# EAGLE design th-566-vco-io (EAGLE 9.6.2)
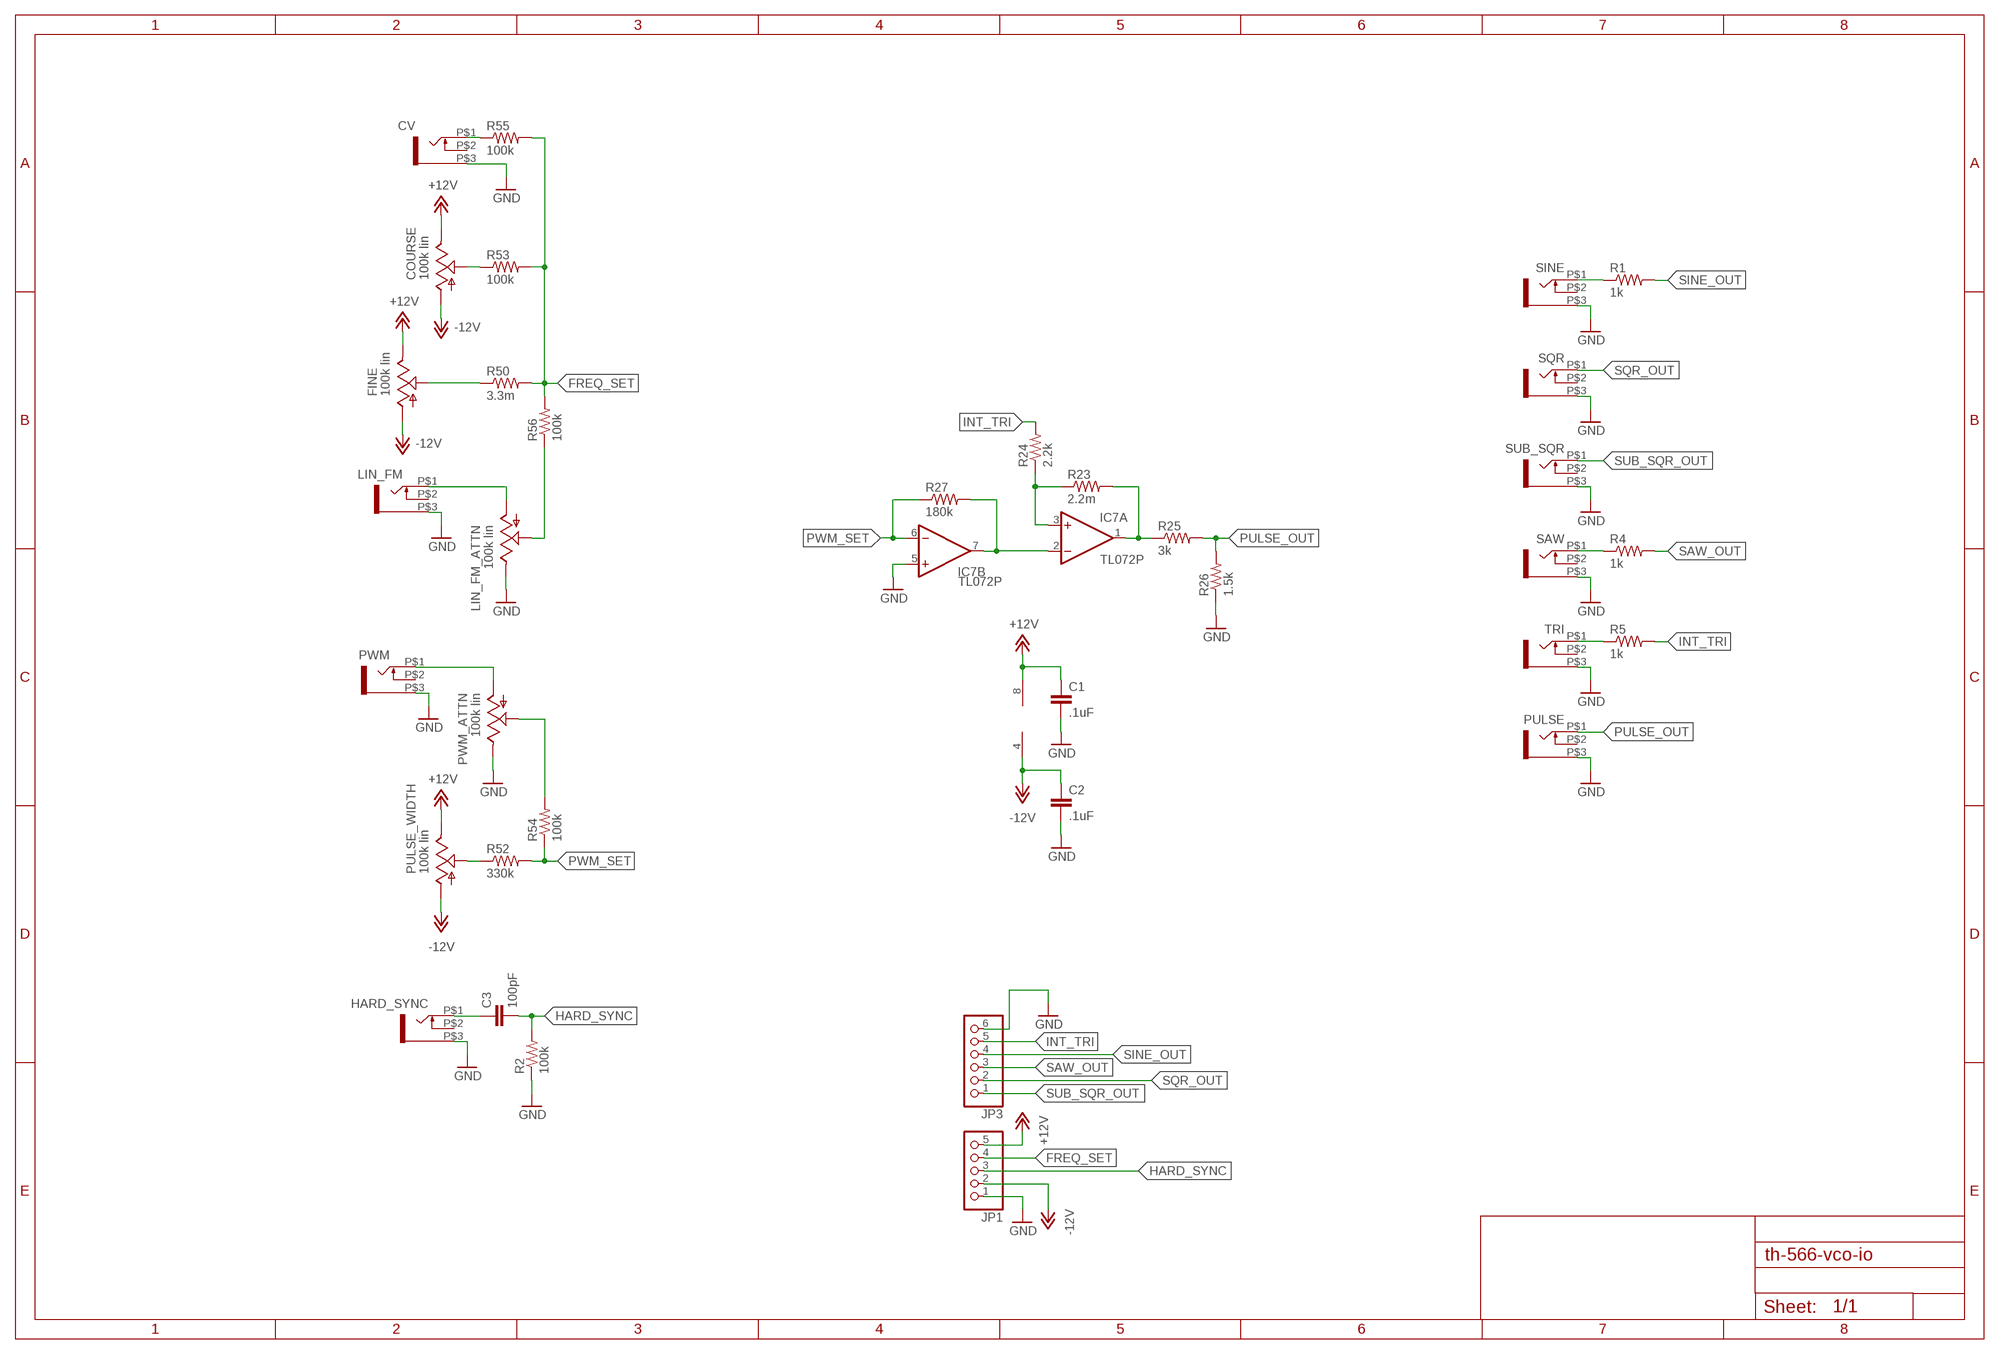
[diagram p0: schematic, sheet 1]

## Parts
C1  .1uF  C-EU050-024X044  [C050-024X044]
C2  .1uF  C-EU050-024X044  [C050-024X044]
C3  100pF  C-EU050-024X044  [C050-024X044]
COURSE  100k lin  ALPHA-9MMA  [EVUF]
CV  WQP-PJ301M-12_JACK  [WQP-PJ301M-12_JACK]
FINE  100k lin  ALPHA-9MMA  [EVUF]
HARD_SYNC  WQP-PJ301M-12_JACK  [WQP-PJ301M-12_JACK]
IC7  TL072P  [DIL08]
JP1  PINHD-1X5  [1X05]
JP3  PINHD-1X6  [1X06]
LIN_FM  WQP-PJ301M-12_JACK  [WQP-PJ301M-12_JACK]
LIN_FM_ATTN  100k lin  ALPHA-9MMA  [EVUF]
PULSE  WQP-PJ301M-12_JACK  [WQP-PJ301M-12_JACK]
PULSE_WIDTH  100k lin  ALPHA-9MMA  [EVUF]
PWM  WQP-PJ301M-12_JACK  [WQP-PJ301M-12_JACK]
PWM_ATTN  100k lin  ALPHA-9MMA  [EVUF]
R1  1k  R-US_0204/7  [0204/7]
R2  100k  R-US_0204/7  [0204/7]
R4  1k  R-US_0204/7  [0204/7]
R5  1k  R-US_0204/7  [0204/7]
R23  2.2m  R-US_0204/7  [0204/7]
R24  2.2k  R-US_0204/7  [0204/7]
R25  3k  R-US_0204/7  [0204/7]
R26  1.5k  R-US_0204/7  [0204/7]
R27  180k  R-US_0204/7  [0204/7]
R50  3.3m  R-US_0204/7  [0204/7]
R52  330k  R-US_0204/7  [0204/7]
R53  100k  R-US_0204/7  [0204/7]
R54  100k  R-US_0204/7  [0204/7]
R55  100k  R-US_0204/7  [0204/7]
R56  100k  R-US_0204/7  [0204/7]
SAW  WQP-PJ301M-12_JACK  [WQP-PJ301M-12_JACK]
SINE  WQP-PJ301M-12_JACK  [WQP-PJ301M-12_JACK]
SQR  WQP-PJ301M-12_JACK  [WQP-PJ301M-12_JACK]
SUB_SQR  WQP-PJ301M-12_JACK  [WQP-PJ301M-12_JACK]
TRI  WQP-PJ301M-12_JACK  [WQP-PJ301M-12_JACK]

## Nets
+12V: C1.1 COURSE.3(E) FINE.3(E) IC7.8(P:V+) JP1.5 PULSE_WIDTH.3(E)
-12V: C2.1 COURSE.1(A) FINE.1(A) IC7.4(P:V-) JP1.2 PULSE_WIDTH.1(A)
FREQ_SET: JP1.4 R50.2 R53.2 R55.2 R56.2
GND: C1.2 C2.2 CV.P$3 HARD_SYNC.P$3 IC7.5(B:+IN) JP1.1 JP3.6 LIN_FM.P$3 LIN_FM_ATTN.3(E) PULSE.P$3 PWM.P$3 PWM_ATTN.3(E) R2.1 R26.1 SAW.P$3 SINE.P$3 SQR.P$3 SUB_SQR.P$3 TRI.P$3
HARD_SYNC: C3.2 JP1.3 R2.2
INT_TRI: JP3.5 R5.2 R24.2
IO_PWM_IN: PWM_ATTN.2(S) R54.2
N$1: R1.1 SINE.P$1
N$2: R5.1 TRI.P$1
N$3: R4.1 SAW.P$1
N$5: C3.1 HARD_SYNC.P$1
N$10: IC7.1(A:OUT) R23.2 R25.1
N$11: IC7.2(A:-IN) IC7.7(B:OUT) R27.2
N$20: IC7.3(A:+IN) R23.1 R24.1
N$37: PWM.P$1 PWM_ATTN.1(A)
N$38: PULSE_WIDTH.2(S) R52.1
N$40: FINE.2(S) R50.1
N$41: COURSE.2(S) R53.1
N$42: CV.P$1 R55.1
N$43: LIN_FM.P$1 LIN_FM_ATTN.1(A)
N$44: LIN_FM_ATTN.2(S) R56.1
PULSE_OUT: PULSE.P$1 R25.2 R26.2
PWM_SET: IC7.6(B:-IN) R27.1 R52.2 R54.1
SAW_OUT: JP3.3 R4.2
SINE_OUT: JP3.4 R1.2
SQR_OUT: JP3.2 SQR.P$1
SUB_SQR_OUT: JP3.1 SUB_SQR.P$1
Unconnected: CV.P$2 HARD_SYNC.P$2 LIN_FM.P$2 PULSE.P$2 PWM.P$2 SAW.P$2 SINE.P$2 SQR.P$2 SUB_SQR.P$2 TRI.P$2

## Library data of the parts
C1-C3 = rcl:C-EU: CAPACITOR, European symbol; SPICEPREFIX: C
COURSE FINE LIN_FM_ATTN PULSE_WIDTH PWM_ATTN = TomW:ALPHA-9MM: 9 mm Square Rotary Potentiometers Source: Panasonic
CV HARD_SYNC LIN_FM PULSE PWM SAW SINE SQR SUB_SQR TRI = thonkiconn:WQP-PJ301M-12_JACK
IC7 = TomW:TL072: OP AMP
JP1 = pinhead:PINHD-1X5: PIN HEADER
JP3 = pinhead:PINHD-1X6: PIN HEADER
R1 R2 R4 R5 R23-R27 R50 R52-R56 = resistor:R-US_: RESISTOR, American symbol

## Board
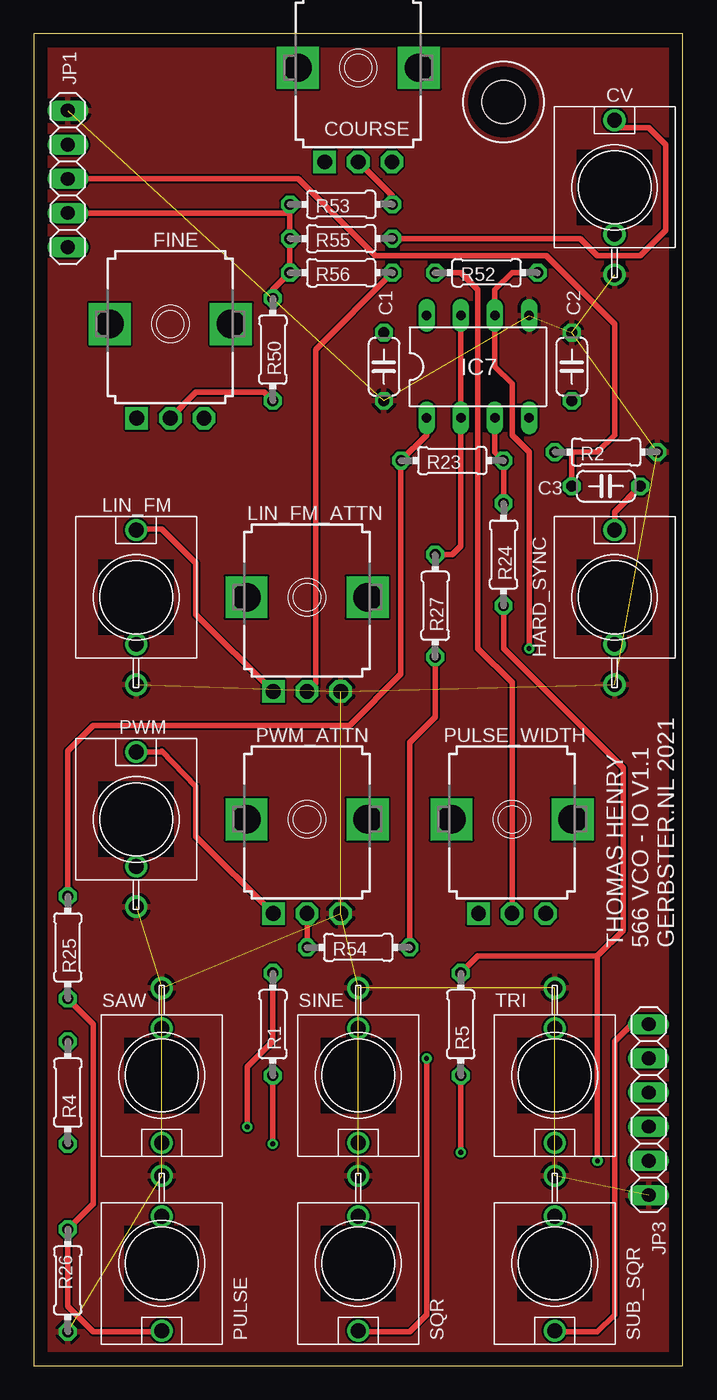
[diagram p1: board, top side]
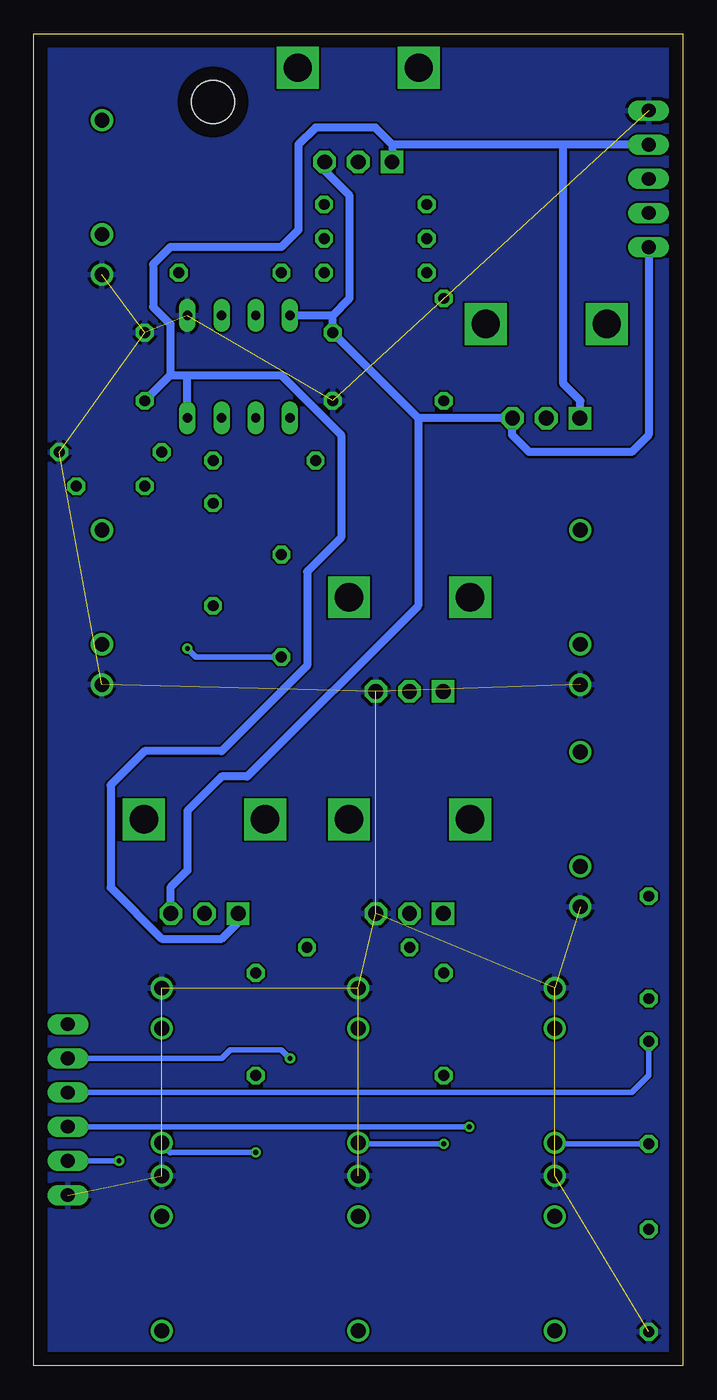
[diagram p2: board, bottom side, seen from below]

Size 48.26 x 99.06 mm. Coordinates in mm from the lower left corner, seen from the top.
Outline: 0,0 48.26,0 48.26,99.06 0,99.05 0,0
Copper layers (1*16): Top 0.035mm / dielectric 1.5mm / Bottom 0.035mm
Design rules "default": minimum track width 6mil, minimum drill 0.35mm, track to track 6mil, track to pad 6mil, pad to pad 6mil, via to via 6mil, smd to smd 6mil, copper to edge 40mil, drill to drill 6mil, minimum pad ring 10mil, minimum via ring 8mil, stop-mask expansion 4mil, vias tented up to drill 0mil, thermal gap 10mil
Holes 3.2 mm at 34.92,93.98

### Footprints (pad centres in the part's own frame; a part is rotated, then mirrored left to right if it is on the bottom)
C050-024X044 = drill 0.813 octagon: 1 -2.54,0; 2 2.54,0
EVUF = drill 1.1 pad 1.676 square: 1 -2.5,-7 | drill 1.1 pad 1.676 octagon: 2 0,-7; 3 2.5,-7 | drill 2.1 pad 2.8 square: M1 4.5,0; M2 -4.5,0
WQP-PJ301M-12_JACK = drill 1.1: P$1 0,5; P$2 0,-3.5; P$3 0,-6.5
DIL08 = drill 0.7 long: 1 -3.81,-3.81; 2 -1.27,-3.81; 3 1.27,-3.81; 4 3.81,-3.81; 5 3.81,3.81; 6 1.27,3.81; 7 -1.27,3.81; 8 -3.81,3.81
1X05 = drill 1.016 long: 1 -5.08,0; 2 -2.54,0; 3 0,0; 4 2.54,0; 5 5.08,0
1X06 = drill 1.016 long: 1 -6.35,0; 2 -3.81,0; 3 -1.27,0; 4 1.27,0; 5 3.81,0; 6 6.35,0
0204/7 = drill 0.813 octagon: 1 -3.81,0; 2 3.81,0

### Placement (x,y rotation side)
C1  26.04,74.3 270 top
C2  40.01,74.3 90 top
C3  42.55,65.41 180 top
COURSE  24.13,96.52 0 top
CV  43.18,87.63 0 top
FINE  10.16,77.47 0 top
HARD_SYNC  43.18,57.15 0 top
IC7  33.02,74.3 0 top
JP1  2.54,88.27 270 top
JP3  45.72,19.05 270 top
LIN_FM  7.62,57.15 0 top
LIN_FM_ATTN  20.32,57.15 0 top
PULSE  9.53,7.62 180 top
PULSE_WIDTH  35.56,40.64 0 top
PWM  7.62,40.64 0 top
PWM_ATTN  20.32,40.64 0 top
R1  17.78,25.4 90 top
R2  42.55,67.94 180 top
R4  2.54,20.32 90 top
R5  31.75,25.4 90 top
R23  31.11,67.31 180 top
R24  34.92,60.33 270 top
R25  2.54,31.11 270 top
R26  2.54,6.35 90 top
R27  29.84,56.52 90 top
R50  17.78,75.56 90 top
R52  33.66,81.28 0 top
R53  22.86,86.36 180 top
R54  24.13,31.11 180 top
R55  22.86,83.82 180 top
R56  22.86,81.28 180 top
SAW  9.53,21.59 180 top
SINE  24.13,21.59 180 top
SQR  24.13,7.62 180 top
SUB_SQR  38.73,7.62 180 top
TRI  38.73,21.59 180 top

### Tracks (layer width: path | path; a pad name or v marks a point on that pad's centre or on a via)
+12V
  Bottom 0.61: JP1.5 2.54,69.22 3.81,67.94 11.43,67.94 12.7,69.22 12.7,70.47 | 12.7,70.48 12.66,70.48 FINE.3 12.7,70.47 | 19.68,70.48 C1.1 26.04,78.11 | 26.04,78.11 IC7.8 | 26.04,78.11 24.77,79.38 24.77,87 26.67,88.9 26.67,89.52 COURSE.3 | 12.7,70.48 19.68,70.48 | PULSE_WIDTH.3 38.1,33.64 38.1,35.56 36.83,36.83 36.83,41.27 34.29,43.81 32.38,43.81 19.68,56.52 19.68,70.48 | 12.7,70.47 12.7,70.48
-12V
  Bottom 0.61: JP1.2 8.89,90.81 | 8.89,90.81 21.59,90.81 | 21.59,90.81 21.59,89.52 COURSE.1 | 21.59,90.81 22.86,92.08 27.3,92.08 28.57,90.81 28.57,84.45 29.84,83.19 38.1,83.19 39.37,81.92 39.37,78.74 38.1,77.47 38.1,73.66 | C2.1 38.1,73.66 | 38.1,73.66 36.83,73.66 | IC7.4 36.83,73.66 | 36.83,73.66 29.84,73.66 25.4,69.22 25.4,61.59 27.94,59.05 27.94,52.07 34.29,45.72 40.01,45.72 42.55,43.18 42.55,35.56 38.73,31.75 34.29,31.75 33.02,33.02 33.02,33.64 PULSE_WIDTH.1 | FINE.1 7.66,70.48 7.62,71.75 8.89,73.03 8.89,90.81
FREQ_SET
  Top 0.406: R53.2 19.05,85.72 | R50.2 17.78,80.01 R56.2 R55.2 19.05,85.72 | JP1.4 19.05,85.72
GND  (18 unrouted)
  pour Bottom: 0,0 0,99.06 48.26,99.06 48.26,0
  pour Top: 0,0 0,99.06 48.26,99.06 48.26,0
HARD_SYNC
  Top 0.406: R2.2 40.01,67.94 | 40.01,67.94 C3.2 | JP1.3 19.68,88.27 25.4,82.55 38.1,82.55 43.18,77.47 43.18,69.22 41.91,67.94 40.01,67.94
INT_TRI  (via drill 0.35)
  Top 0.406: v41.91,15.24 41.91,30.48 | R5.2 33.02,30.48 41.91,30.48 | 41.91,30.48 43.81,32.38 43.81,44.45 34.92,53.34 R24.2
  Bottom 0.406: JP3.5 v41.91,15.24
IO_PWM_IN
  Top 0.406: R54.2 PWM_ATTN.2
N$1  (via drill 0.35)
  Top 0.406: R1.1 v17.78,16.51
  Bottom 0.406: SINE.P$1 24.05,16.51 v17.78,16.51
N$2  (via drill 0.35)
  Top 0.406: R5.1 v31.75,15.88
  Bottom 0.406: v31.75,15.88 38.1,15.88 38.1,15.84 38.73,16.51 TRI.P$1
N$3
  Bottom 0.406: SAW.P$1 10.08,16.51 R4.1
N$5
  Top 0.406: HARD_SYNC.P$1 43.18,63.5 C3.1
N$10
  Top 0.406: IC7.1 29.21,69.22 R23.2 27.3,51.44 23.5,47.62 4.45,47.62 2.54,45.72 R25.1
N$11
  Top 0.406: R27.2 31.11,60.33 31.75,60.96 IC7.2 IC7.7
N$20
  Top 0.406: R24.1 R23.1 34.29,67.94 IC7.3
N$37
  Top 0.406: PWM.P$1 9.53,45.64 9.53,45.72 12.06,43.1 12.06,39.35 PWM_ATTN.1
N$38
  Top 0.406: R52.1 31.75,81.28 33.02,80.01 33.02,53.34 35.56,50.8 PULSE_WIDTH.2
N$40
  Top 0.406: FINE.2 12.06,72.39 17.14,72.39 R50.1
N$41
  Top 0.406: COURSE.2 26.67,87 R53.1
N$42
  Top 0.406: R55.1 40.64,83.82 41.91,82.55 45.09,82.55 46.99,84.45 46.99,90.81 45.72,92.08 43.18,92.08 CV.P$1 43.18,92.71
N$43
  Top 0.406: LIN_FM.P$1 7.62,62.23 9.53,62.23 12.06,59.69 12.06,55.87 LIN_FM_ATTN.1
N$44
  Top 0.406: LIN_FM_ATTN.2 20.95,50.78 20.95,75.56 R56.1
PULSE_OUT
  Top 0.406: PULSE.P$1 10.16,2.54 4.45,2.54 2.54,4.45 R26.2 4.45,12.06 4.45,25.4 R25.2
PWM_SET  (via drill 0.35)
  Top 0.406: R52.2 35.56,81.28 34.29,80.01 IC7.6 34.29,74.3 35.56,73.03 35.56,69.22 36.83,67.94 v36.83,53.34 | R27.1 29.84,48.26 27.94,46.35 R54.1
  Bottom 0.406: v36.83,53.34 36.2,52.7 R27.1
SAW_OUT
  Bottom 0.406: R4.2 2.54,21.59 3.81,20.32 JP3.3
SINE_OUT  (via drill 0.35)
  Top 0.406: R1.2 17.78,24.13 15.88,22.23 v15.88,17.78
  Bottom 0.406: v15.88,17.78 JP3.4
SQR_OUT  (via drill 0.35)
  Top 0.406: v29.21,22.86 29.21,3.81 27.94,2.54 24.77,2.54 SQR.P$1
  Bottom 0.406: JP3.2 34.29,22.86 33.66,23.5 29.84,23.5 v29.21,22.86
SUB_SQR_OUT
  Top 0.406: JP3.1 44.45,25.4 43.18,24.13 43.18,3.81 41.91,2.54 38.1,2.54 SUB_SQR.P$1

### Text on the board
tNames: THOMAS HENRY / 566 VCO / GERBSTER.NL 2021 | THOMAS HENRY / 566 VCO - IO V1.1 / GERBSTER.NL 2021